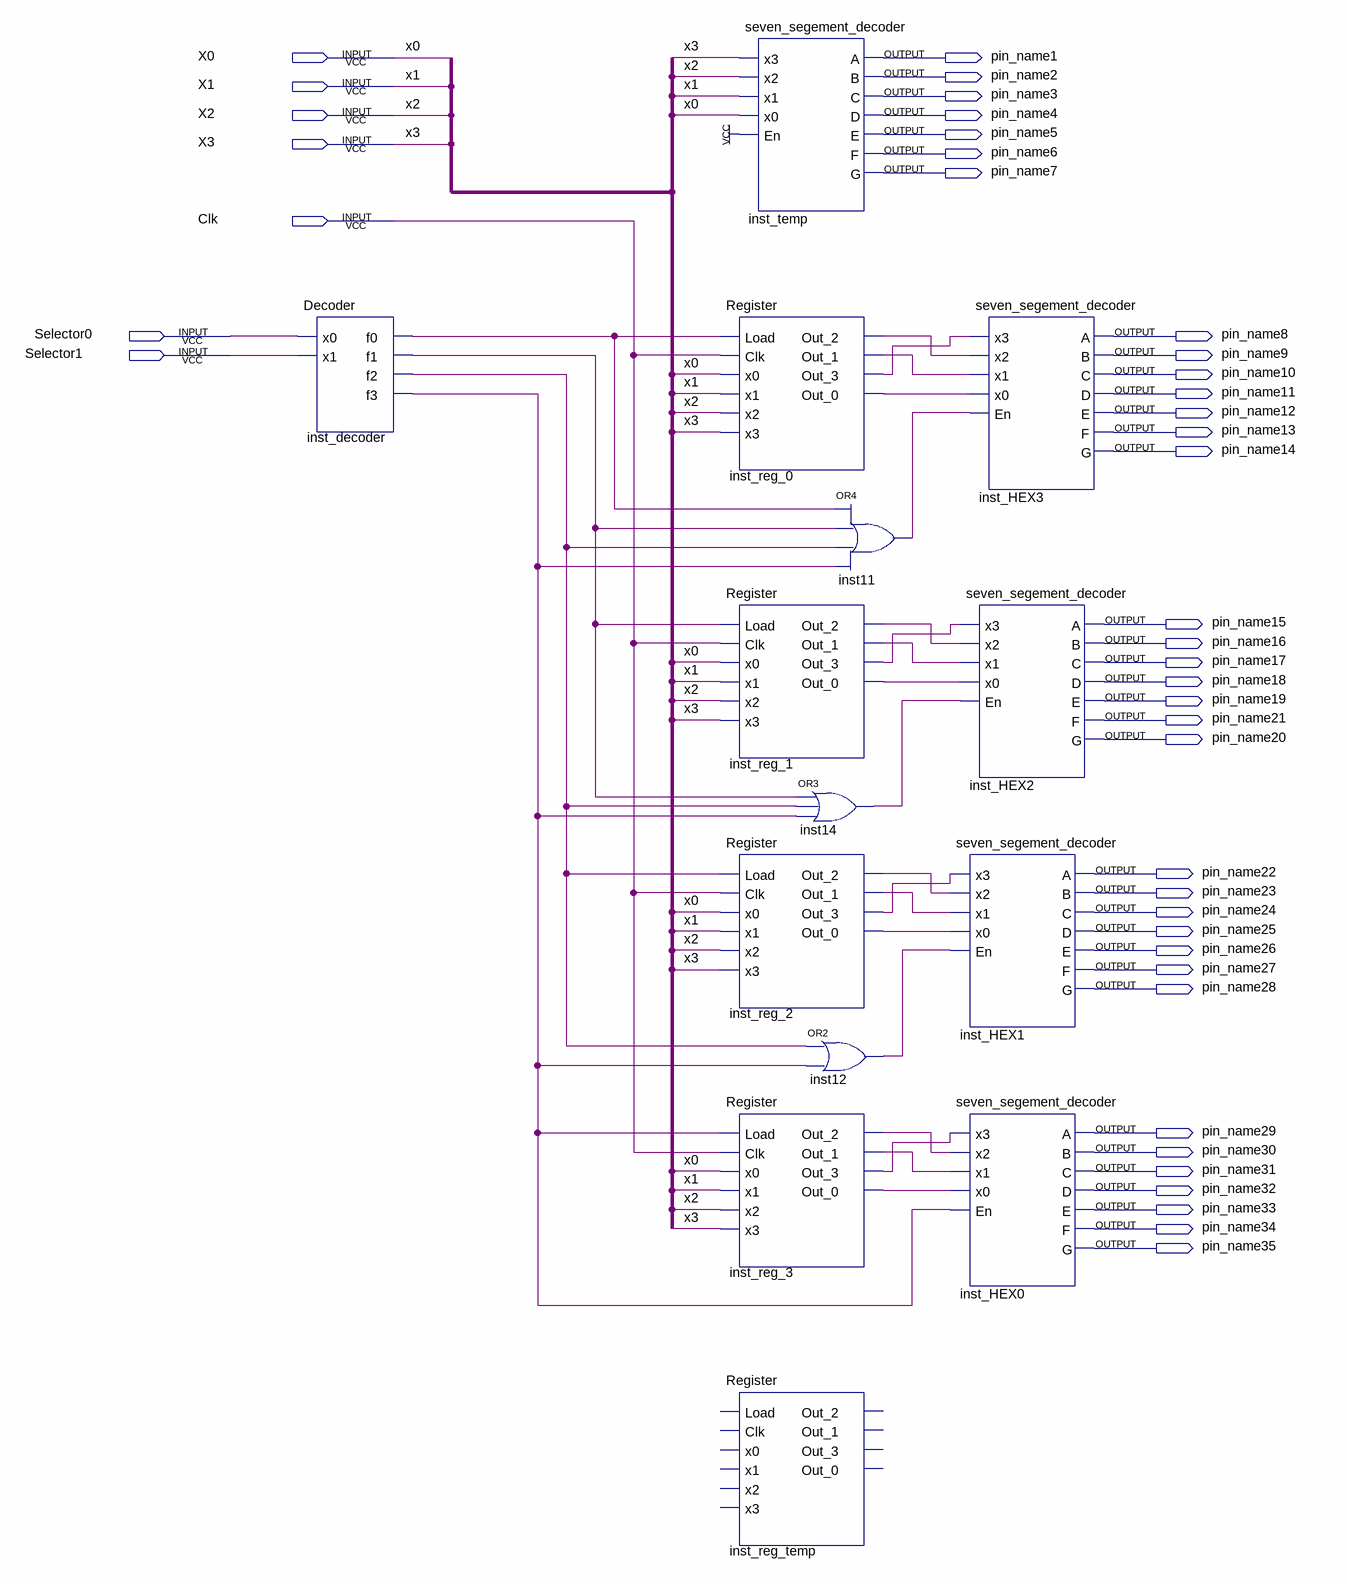
[diagram p0: schematic sheet]
// Quartus schematic FinalProj.bdf as structural Verilog: 14 symbols, 42 pins
module FinalProj (
  input  X0,
  input  X1,
  input  X2,
  input  X3,
  input  Clk,
  input  Selector0,
  input  Selector1,
  output pin_name1,
  output pin_name2,
  output pin_name3,
  output pin_name4,
  output pin_name5,
  output pin_name6,
  output pin_name7,
  output pin_name8,
  output pin_name9,
  output pin_name10,
  output pin_name11,
  output pin_name12,
  output pin_name13,
  output pin_name14,
  output pin_name15,
  output pin_name16,
  output pin_name17,
  output pin_name18,
  output pin_name19,
  output pin_name21,
  output pin_name20,
  output pin_name22,
  output pin_name23,
  output pin_name24,
  output pin_name25,
  output pin_name26,
  output pin_name27,
  output pin_name28,
  output pin_name29,
  output pin_name30,
  output pin_name31,
  output pin_name32,
  output pin_name33,
  output pin_name34,
  output pin_name35
);

  wire inst11_out, inst12_out, inst14_out, inst_decoder_f0, inst_decoder_f1, inst_decoder_f2,
       inst_decoder_f3, inst_reg_0_out_0, inst_reg_0_out_1, inst_reg_0_out_2, inst_reg_0_out_3,
       inst_reg_1_out_0, inst_reg_1_out_1, inst_reg_1_out_2, inst_reg_1_out_3, inst_reg_2_out_0,
       inst_reg_2_out_1, inst_reg_2_out_2, inst_reg_2_out_3, inst_reg_3_out_0, inst_reg_3_out_1,
       inst_reg_3_out_2, inst_reg_3_out_3;

  Decoder inst_decoder (
    .x0(Selector0), .x1(Selector1), .f0(inst_decoder_f0), .f1(inst_decoder_f1), .f2(inst_decoder_f2),
    .f3(inst_decoder_f3));
  seven_segement_decoder inst_temp (
    .x3(X3), .x2(X2), .x1(X1), .x0(X0), .En(1'b1), .A(pin_name1), .B(pin_name2), .C(pin_name3),
    .D(pin_name4), .E(pin_name5), .F(pin_name6), .G(pin_name7));
  Register inst_reg_0 (
    .Load(inst_decoder_f0), .Clk(Clk), .x0(X0), .x1(X1), .x2(X2), .x3(X3), .Out_2(inst_reg_0_out_2),
    .Out_1(inst_reg_0_out_1), .Out_3(inst_reg_0_out_3), .Out_0(inst_reg_0_out_0));
  Register inst_reg_1 (
    .Load(inst_decoder_f1), .Clk(Clk), .x0(X0), .x1(X1), .x2(X2), .x3(X3), .Out_2(inst_reg_1_out_2),
    .Out_1(inst_reg_1_out_1), .Out_3(inst_reg_1_out_3), .Out_0(inst_reg_1_out_0));
  Register inst_reg_2 (
    .Load(inst_decoder_f2), .Clk(Clk), .x0(X0), .x1(X1), .x2(X2), .x3(X3), .Out_2(inst_reg_2_out_2),
    .Out_1(inst_reg_2_out_1), .Out_3(inst_reg_2_out_3), .Out_0(inst_reg_2_out_0));
  Register inst_reg_3 (
    .Load(inst_decoder_f3), .Clk(Clk), .x0(X0), .x1(X1), .x2(X2), .x3(X3), .Out_2(inst_reg_3_out_2),
    .Out_1(inst_reg_3_out_1), .Out_3(inst_reg_3_out_3), .Out_0(inst_reg_3_out_0));
  Register inst_reg_temp ();  // open: Load, Clk, x0, x1, x2, x3, Out_2, Out_1, Out_3, Out_0
  or inst11 (inst11_out, inst_decoder_f0, inst_decoder_f1, inst_decoder_f2, inst_decoder_f3);
  or inst14 (inst14_out, inst_decoder_f1, inst_decoder_f2, inst_decoder_f3);
  or inst12 (inst12_out, inst_decoder_f2, inst_decoder_f3);
  seven_segement_decoder inst_HEX3 (
    .x3(inst_reg_0_out_3), .x2(inst_reg_0_out_2), .x1(inst_reg_0_out_1), .x0(inst_reg_0_out_0),
    .En(inst11_out), .A(pin_name8), .B(pin_name9), .C(pin_name10), .D(pin_name11), .E(pin_name12),
    .F(pin_name13), .G(pin_name14));
  seven_segement_decoder inst_HEX2 (
    .x3(inst_reg_1_out_3), .x2(inst_reg_1_out_2), .x1(inst_reg_1_out_1), .x0(inst_reg_1_out_0),
    .En(inst14_out), .A(pin_name15), .B(pin_name16), .C(pin_name17), .D(pin_name18), .E(pin_name19),
    .F(pin_name21), .G(pin_name20));
  seven_segement_decoder inst_HEX1 (
    .x3(inst_reg_2_out_3), .x2(inst_reg_2_out_2), .x1(inst_reg_2_out_1), .x0(inst_reg_2_out_0),
    .En(inst12_out), .A(pin_name22), .B(pin_name23), .C(pin_name24), .D(pin_name25), .E(pin_name26),
    .F(pin_name27), .G(pin_name28));
  seven_segement_decoder inst_HEX0 (
    .x3(inst_reg_3_out_3), .x2(inst_reg_3_out_2), .x1(inst_reg_3_out_1), .x0(inst_reg_3_out_0),
    .En(inst_decoder_f3), .A(pin_name29), .B(pin_name30), .C(pin_name31), .D(pin_name32), .E(pin_name33),
    .F(pin_name34), .G(pin_name35));
endmodule
